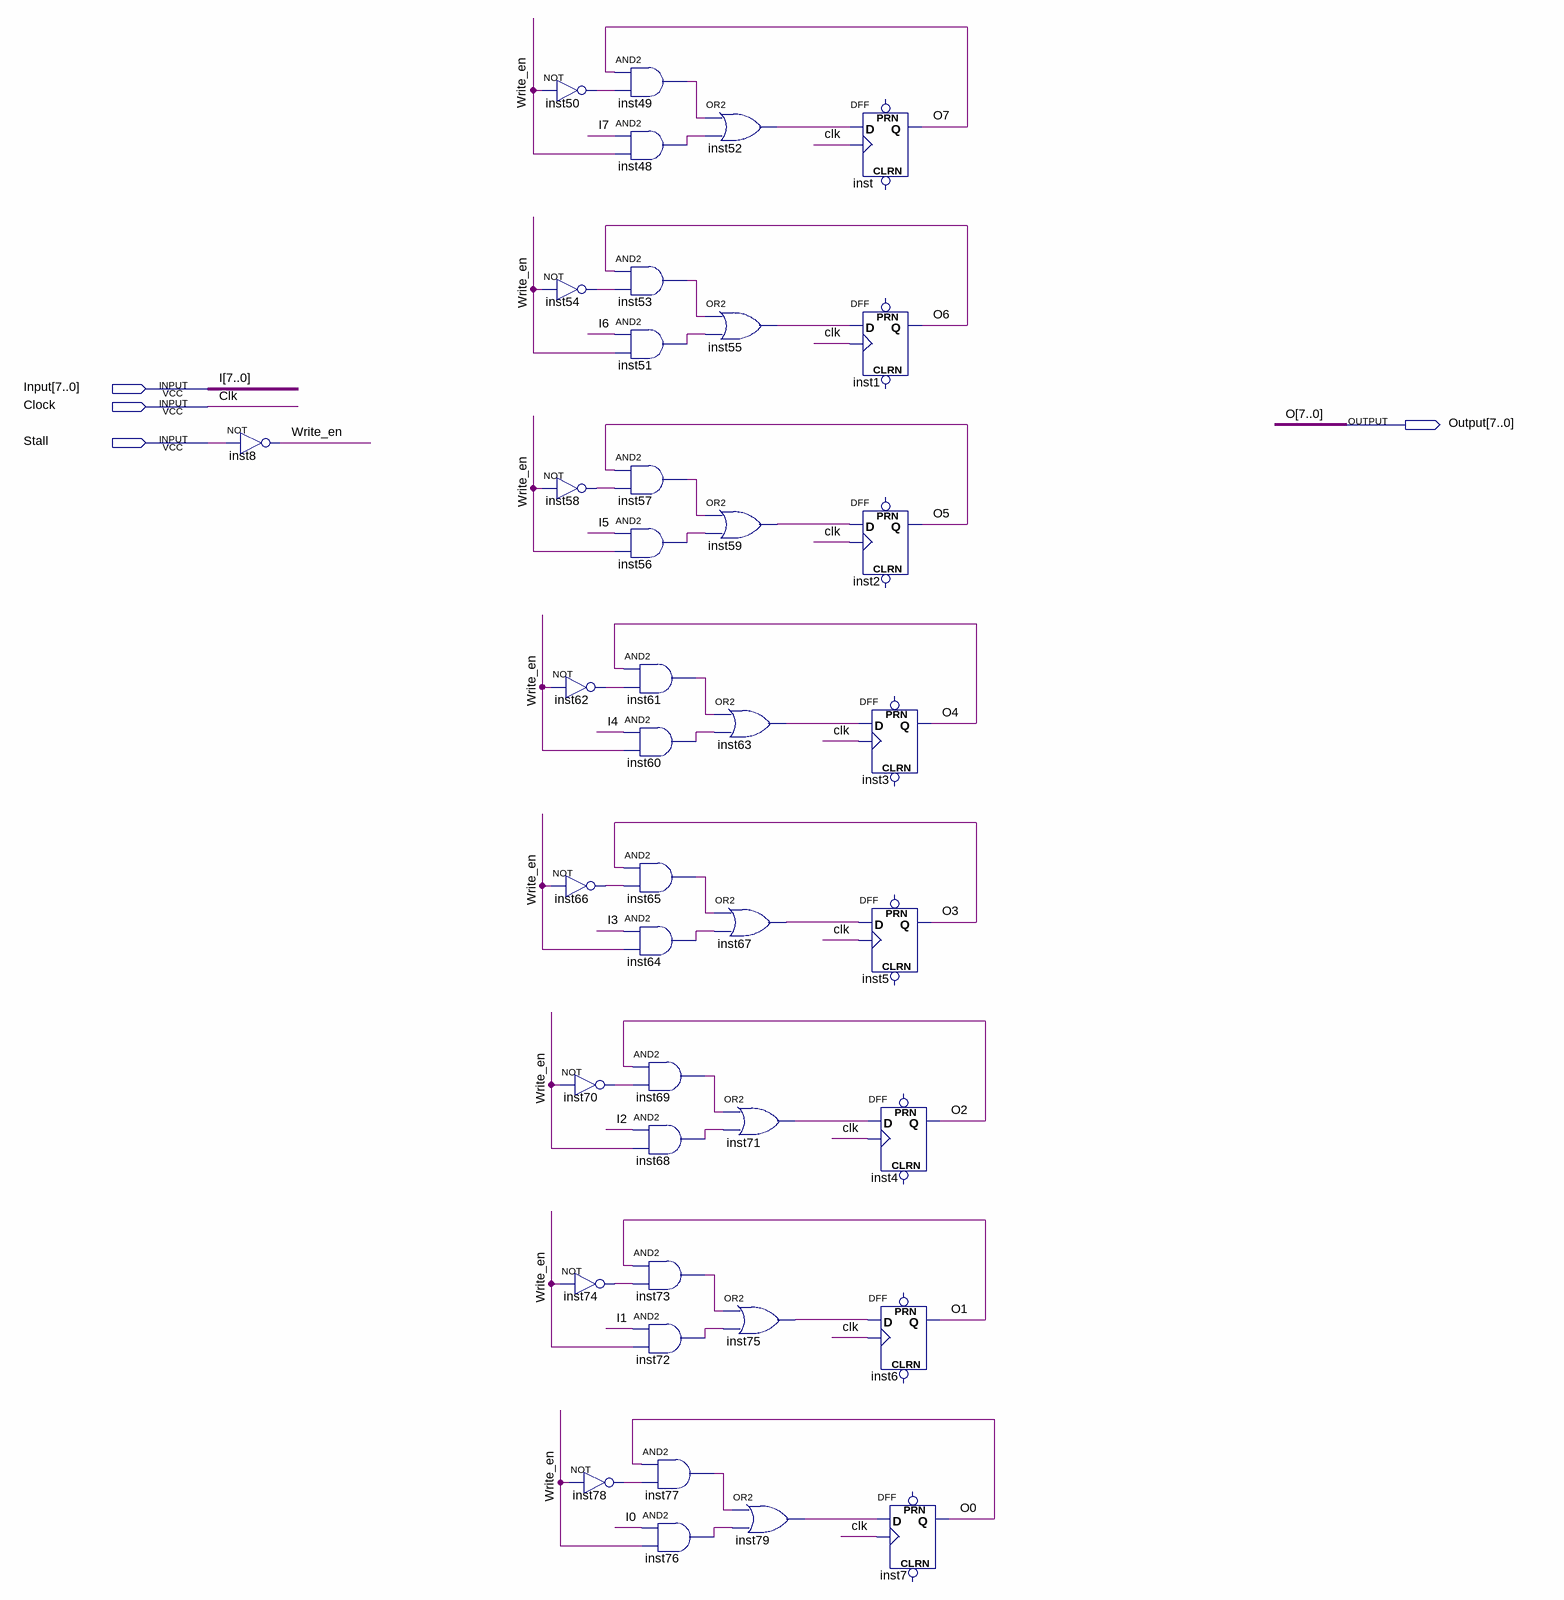
[diagram p0: schematic sheet]
// Quartus schematic PC.bdf as structural Verilog: 41 symbols, 4 pins
module PC (
  input  [7:0] Input,
  input  Clock,
  input  Stall,
  output [7:0] Output
);

  wire inst48_out, inst49_out, inst50_out, inst51_out, inst52_out, inst53_out, inst54_out, inst55_out,
       inst56_out, inst57_out, inst58_out, inst59_out, inst60_out, inst61_out, inst62_out, inst63_out,
       inst64_out, inst65_out, inst66_out, inst67_out, inst68_out, inst69_out, inst70_out, inst71_out,
       inst72_out, inst73_out, inst74_out, inst75_out, inst76_out, inst77_out, inst78_out, inst79_out,
       Write_en;

  not inst8 (Write_en, Stall);
  not inst50 (inst50_out, Write_en);
  not inst54 (inst54_out, Write_en);
  not inst58 (inst58_out, Write_en);
  not inst62 (inst62_out, Write_en);
  not inst66 (inst66_out, Write_en);
  and inst49 (inst49_out, Output[7], inst50_out);
  and inst48 (inst48_out, Input[7], Write_en);
  and inst53 (inst53_out, Output[6], inst54_out);
  and inst51 (inst51_out, Input[6], Write_en);
  and inst57 (inst57_out, Output[5], inst58_out);
  and inst56 (inst56_out, Input[5], Write_en);
  and inst61 (inst61_out, Output[4], inst62_out);
  and inst60 (inst60_out, Input[4], Write_en);
  and inst65 (inst65_out, Output[3], inst66_out);
  and inst64 (inst64_out, Input[3], Write_en);
  not inst70 (inst70_out, Write_en);
  not inst74 (inst74_out, Write_en);
  not inst78 (inst78_out, Write_en);
  and inst69 (inst69_out, Output[2], inst70_out);
  and inst68 (inst68_out, Input[2], Write_en);
  and inst73 (inst73_out, Output[1], inst74_out);
  and inst72 (inst72_out, Input[1], Write_en);
  and inst77 (inst77_out, Output[0], inst78_out);
  and inst76 (inst76_out, Input[0], Write_en);
  or inst52 (inst52_out, inst49_out, inst48_out);
  or inst55 (inst55_out, inst53_out, inst51_out);
  or inst59 (inst59_out, inst57_out, inst56_out);
  or inst63 (inst63_out, inst61_out, inst60_out);
  or inst67 (inst67_out, inst65_out, inst64_out);
  or inst71 (inst71_out, inst69_out, inst68_out);
  or inst75 (inst75_out, inst73_out, inst72_out);
  or inst79 (inst79_out, inst77_out, inst76_out);
  DFF inst (.CLK(Clock), .D(inst52_out), .Q(Output[7]));  // open: CLRN, PRN
  DFF inst1 (.CLK(Clock), .D(inst55_out), .Q(Output[6]));  // open: CLRN, PRN
  DFF inst2 (.CLK(Clock), .D(inst59_out), .Q(Output[5]));  // open: CLRN, PRN
  DFF inst3 (.CLK(Clock), .D(inst63_out), .Q(Output[4]));  // open: CLRN, PRN
  DFF inst5 (.CLK(Clock), .D(inst67_out), .Q(Output[3]));  // open: CLRN, PRN
  DFF inst4 (.CLK(Clock), .D(inst71_out), .Q(Output[2]));  // open: CLRN, PRN
  DFF inst6 (.CLK(Clock), .D(inst75_out), .Q(Output[1]));  // open: CLRN, PRN
  DFF inst7 (.CLK(Clock), .D(inst79_out), .Q(Output[0]));  // open: CLRN, PRN

  // Other names for the same wires on the sheet: Clk = Clock; I[7:0] = Input; I0 = Input[0]; I1 = Input[1];
  //   I2 = Input[2]; I3 = Input[3]; I4 = Input[4]; I5 = Input[5]; I6 = Input[6]; I7 = Input[7]; O[7:0] = Output;
  //   O0 = Output[0]; O1 = Output[1]; O2 = Output[2]; O3 = Output[3]; O4 = Output[4]; O5 = Output[5]; O6 = Output[6];
  //   O7 = Output[7]
endmodule
